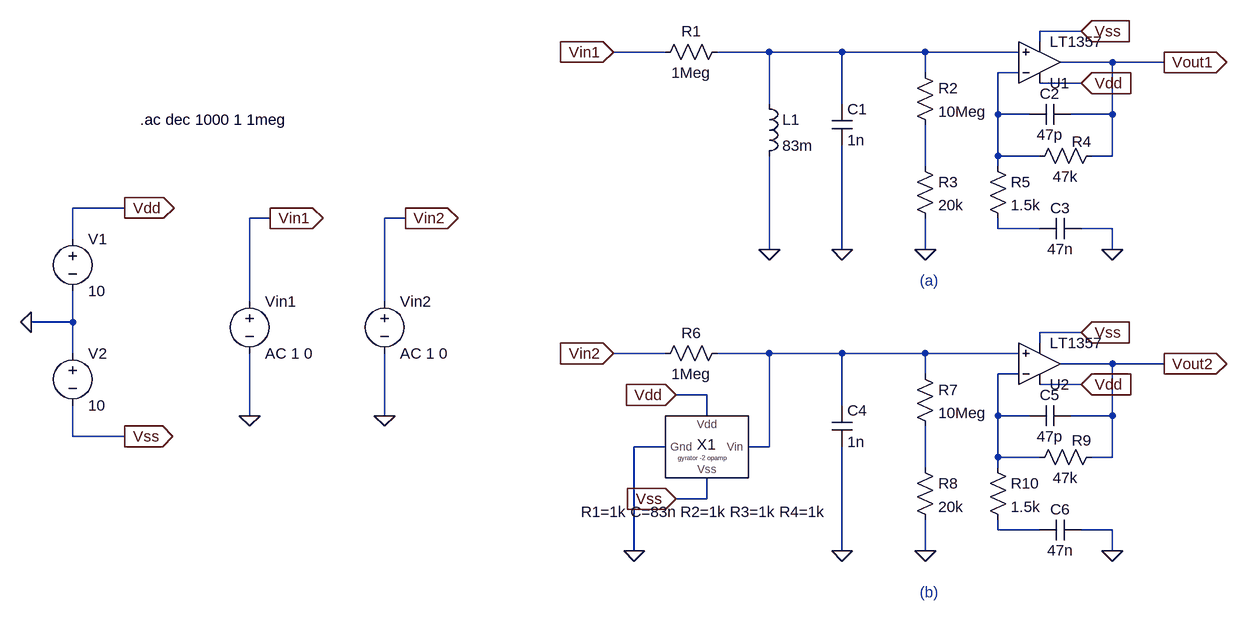
[diagram p0: schematic vlf receiver.asc]
vlf receiver.asc, the LTspice schematic file:
Version 4
SHEET 1 1444 996
WIRE 1200 -32 1136 -32
WIRE 1136 -16 1136 -32
WIRE 560 0 480 0
WIRE 720 0 640 0
WIRE 832 0 720 0
WIRE 960 0 832 0
WIRE 1104 0 960 0
WIRE 1248 16 1168 16
WIRE 1328 16 1248 16
WIRE 960 32 960 0
WIRE 1104 32 1072 32
WIRE 1200 48 1136 48
WIRE 720 80 720 0
WIRE 832 80 832 0
WIRE 1072 96 1072 32
WIRE 1120 96 1072 96
WIRE 1248 96 1248 16
WIRE 1248 96 1184 96
WIRE 1072 160 1072 96
WIRE 1136 160 1072 160
WIRE 1248 160 1248 96
WIRE 1248 160 1216 160
WIRE 960 176 960 112
WIRE 1072 176 1072 160
WIRE -272 240 -352 240
WIRE -48 256 -80 256
WIRE 160 256 128 256
WIRE 1072 272 1072 256
WIRE 1136 272 1072 272
WIRE 1248 272 1200 272
WIRE -352 288 -352 240
WIRE 720 304 720 160
WIRE 832 304 832 144
WIRE 960 304 960 256
WIRE 1248 304 1248 272
WIRE -80 384 -80 256
WIRE 128 384 128 256
WIRE -352 416 -352 368
WIRE -352 416 -416 416
WIRE 1200 432 1136 432
WIRE 1136 448 1136 432
WIRE -352 464 -352 416
WIRE 560 464 480 464
WIRE 720 464 640 464
WIRE 832 464 720 464
WIRE 960 464 832 464
WIRE 1104 464 960 464
WIRE 1248 480 1168 480
WIRE 1328 480 1248 480
WIRE 960 496 960 464
WIRE 1104 496 1072 496
WIRE 1200 512 1136 512
WIRE 624 528 576 528
WIRE 832 544 832 464
WIRE -80 560 -80 464
WIRE 128 560 128 464
WIRE 624 560 624 528
WIRE 1072 560 1072 496
WIRE 1120 560 1072 560
WIRE 1248 560 1248 480
WIRE 1248 560 1184 560
WIRE -352 592 -352 544
WIRE -272 592 -352 592
WIRE 560 608 512 608
WIRE 720 608 720 464
WIRE 720 608 688 608
WIRE 1072 624 1072 560
WIRE 1136 624 1072 624
WIRE 1248 624 1248 560
WIRE 1248 624 1216 624
WIRE 960 640 960 576
WIRE 1072 640 1072 624
WIRE 624 688 624 656
WIRE 624 688 576 688
WIRE 1072 736 1072 720
WIRE 1136 736 1072 736
WIRE 1248 736 1200 736
WIRE 512 768 512 608
WIRE 832 768 832 608
WIRE 960 768 960 720
WIRE 1248 768 1248 736
FLAG -80 560 0
FLAG -48 256 Vin1
IOPIN -48 256 Out
FLAG -416 416 0
FLAG -272 240 Vdd
IOPIN -272 240 Out
FLAG -272 592 Vss
IOPIN -272 592 Out
FLAG 128 560 0
FLAG 160 256 Vin2
IOPIN 160 256 Out
FLAG 720 304 0
FLAG 832 304 0
FLAG 960 304 0
FLAG 1248 304 0
FLAG 1200 48 Vdd
IOPIN 1200 48 In
FLAG 1200 -32 Vss
IOPIN 1200 -32 In
FLAG 1328 16 Vout1
IOPIN 1328 16 Out
FLAG 480 0 Vin1
IOPIN 480 0 In
FLAG 832 768 0
FLAG 960 768 0
FLAG 1248 768 0
FLAG 1200 512 Vdd
IOPIN 1200 512 In
FLAG 1200 432 Vss
IOPIN 1200 432 In
FLAG 1328 480 Vout2
IOPIN 1328 480 Out
FLAG 480 464 Vin2
IOPIN 480 464 In
FLAG 512 768 0
FLAG 576 528 Vdd
IOPIN 576 528 In
FLAG 576 688 Vss
IOPIN 576 688 In
SYMBOL voltage -80 368 R0
WINDOW 123 0 0 Left 0
WINDOW 39 0 0 Left 0
SYMATTR InstName Vin1
SYMATTR Value AC 1 0
SYMBOL voltage -352 272 R0
WINDOW 123 0 0 Left 0
WINDOW 39 0 0 Left 0
SYMATTR InstName V1
SYMATTR Value 10
SYMBOL voltage -352 448 R0
WINDOW 123 0 0 Left 0
WINDOW 39 0 0 Left 0
SYMATTR InstName V2
SYMATTR Value 10
SYMBOL voltage 128 368 R0
WINDOW 123 0 0 Left 0
WINDOW 39 0 0 Left 0
SYMATTR InstName Vin2
SYMATTR Value AC 1 0
SYMBOL res 656 -16 R90
WINDOW 0 0 56 VBottom 2
WINDOW 3 32 56 VTop 2
SYMATTR InstName R1
SYMATTR Value 1Meg
SYMBOL ind 704 64 R0
SYMATTR InstName L1
SYMATTR Value 83m
SYMBOL cap 816 80 R0
SYMATTR InstName C1
SYMATTR Value 1n
SYMBOL res 944 16 R0
SYMATTR InstName R2
SYMATTR Value 10Meg
SYMBOL res 944 160 R0
SYMATTR InstName R3
SYMATTR Value 20k
SYMBOL OpAmps\\LT1357 1136 80 M180
SYMATTR InstName U1
SYMBOL cap 1184 80 R90
WINDOW 0 0 32 VBottom 2
WINDOW 3 32 32 VTop 2
SYMATTR InstName C2
SYMATTR Value 47p
SYMBOL res 1232 144 R90
WINDOW 0 10 31 VBottom 2
WINDOW 3 32 56 VTop 2
SYMATTR InstName R4
SYMATTR Value 47k
SYMBOL res 1056 160 R0
SYMATTR InstName R5
SYMATTR Value 1.5k
SYMBOL cap 1200 256 R90
WINDOW 0 0 32 VBottom 2
WINDOW 3 32 32 VTop 2
SYMATTR InstName C3
SYMATTR Value 47n
SYMBOL res 656 448 R90
WINDOW 0 0 56 VBottom 2
WINDOW 3 32 56 VTop 2
SYMATTR InstName R6
SYMATTR Value 1Meg
SYMBOL cap 816 544 R0
SYMATTR InstName C4
SYMATTR Value 1n
SYMBOL res 944 480 R0
SYMATTR InstName R7
SYMATTR Value 10Meg
SYMBOL res 944 624 R0
SYMATTR InstName R8
SYMATTR Value 20k
SYMBOL OpAmps\\LT1357 1136 544 M180
SYMATTR InstName U2
SYMBOL cap 1184 544 R90
WINDOW 0 0 32 VBottom 2
WINDOW 3 32 32 VTop 2
SYMATTR InstName C5
SYMATTR Value 47p
SYMBOL res 1232 608 R90
WINDOW 0 6 31 VBottom 2
WINDOW 3 32 56 VTop 2
SYMATTR InstName R9
SYMATTR Value 47k
SYMBOL res 1056 624 R0
SYMATTR InstName R10
SYMATTR Value 1.5k
SYMBOL cap 1200 720 R90
WINDOW 0 0 32 VBottom 2
WINDOW 3 32 32 VTop 2
SYMATTR InstName C6
SYMATTR Value 47n
SYMBOL Gyr2 624 592 M0
WINDOW 0 1 28 Bottom 2
WINDOW 39 3 132 Bottom 2
SYMATTR InstName X1
SYMATTR SpiceLine R1=1k C=83n R2=1k R3=1k R4=1k
TEXT 952 352 Left 2 ;(a)
TEXT 952 832 Left 2 ;(b)
TEXT -248 104 Left 2 !.ac dec 1000 1 1meg

The netlist it stands for:
* vlf receiver.asc
Vin1 Vin1 0 AC 1 0
V1 Vdd 0 10
V2 0 Vss 10
Vin2 Vin2 0 AC 1 0
R1 N001 Vin1 1Meg
L1 N001 0 83m
C1 N001 0 1n
R2 N001 N003 10Meg
R3 N003 0 20k
XU1 N001 N002 Vdd Vss Vout1 LT1357  ; pins In+ In- V+ V- OUT
C2 Vout1 N002 47p
R4 Vout1 N002 47k
R5 N002 N004 1.5k
C3 0 N004 47n
R6 N005 Vin2 1Meg
C4 N005 0 1n
R7 N005 N007 10Meg
R8 N007 0 20k
XU2 N005 N006 Vdd Vss Vout2 LT1357  ; pins In+ In- V+ V- OUT
C5 Vout2 N006 47p
R9 Vout2 N006 47k
R10 N006 N008 1.5k
C6 0 N008 47n
XX1 0 Vdd Vss N005 Gyr2 R1=1k C=83n R2=1k R3=1k R4=1k  ; pins Gnd Vdd Vss Vin
* (a)
* (b)
.ac dec 1000 1 1meg
.backanno
.end